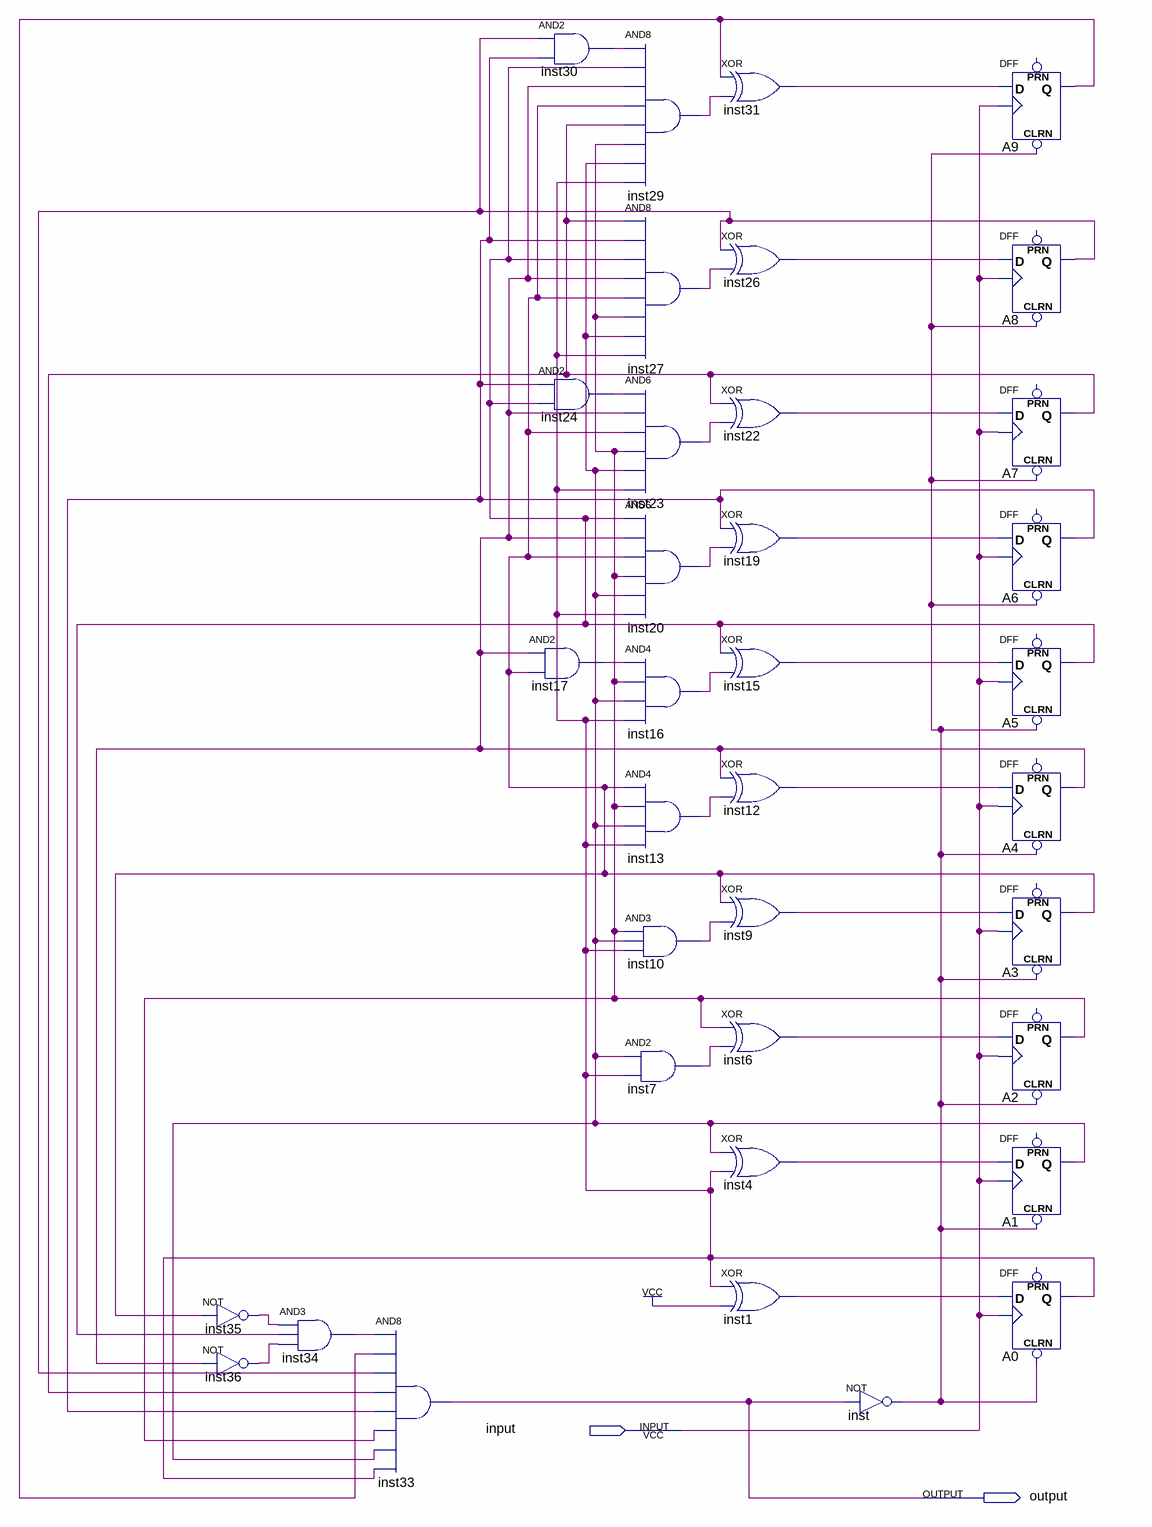
[diagram p0: schematic sheet]
// Quartus schematic time.bdf as structural Verilog: 36 symbols, 2 pins
module \time  (
  input  \input ,
  output \output 
);

  wire A0_q, A1_q, A2_q, A3_q, A4_q, A5_q, A6_q, A7_q, A8_q, A9_q, inst1_out, inst4_out, inst6_out,
       inst7_out, inst9_out, inst10_out, inst12_out, inst13_out, inst15_out, inst16_out, inst17_out,
       inst19_out, inst20_out, inst22_out, inst23_out, inst24_out, inst26_out, inst27_out, inst29_out,
       inst30_out, inst31_out, inst34_out, inst35_out, inst36_out, inst_out;

  not inst35 (inst35_out, A3_q);
  not inst36 (inst36_out, A4_q);
  and inst34 (inst34_out, inst35_out, A5_q, inst36_out);
  and inst33 (\output , inst34_out, A9_q, A8_q, A7_q, A6_q, A2_q, A1_q, A0_q);
  and inst30 (inst30_out, A8_q, A6_q);
  and inst24 (inst24_out, A6_q, A5_q);
  and inst17 (inst17_out, A4_q, A3_q);
  and inst29 (inst29_out, inst30_out, A5_q, A4_q, A3_q, A7_q, A2_q, A1_q, A0_q);
  and inst27 (inst27_out, A7_q, A6_q, A5_q, A4_q, A3_q, A2_q, A1_q, A0_q);
  and inst23 (inst23_out, inst24_out, A4_q, A3_q, A2_q, A1_q, A0_q);
  and inst20 (inst20_out, A5_q, A4_q, A3_q, A2_q, A1_q, A0_q);
  and inst16 (inst16_out, inst17_out, A2_q, A1_q, A0_q);
  and inst13 (inst13_out, A3_q, A2_q, A1_q, A0_q);
  and inst10 (inst10_out, A2_q, A1_q, A0_q);
  and inst7 (inst7_out, A1_q, A0_q);
  xor inst31 (inst31_out, A9_q, inst29_out);
  xor inst26 (inst26_out, A8_q, inst27_out);
  xor inst22 (inst22_out, A7_q, inst23_out);
  xor inst19 (inst19_out, A6_q, inst20_out);
  xor inst15 (inst15_out, A5_q, inst16_out);
  xor inst12 (inst12_out, A4_q, inst13_out);
  xor inst9 (inst9_out, A3_q, inst10_out);
  xor inst6 (inst6_out, A2_q, inst7_out);
  xor inst4 (inst4_out, A1_q, A0_q);
  xor inst1 (inst1_out, A0_q, 1'b1);
  not inst (inst_out, \output );
  DFF A9 (.CLRN(inst_out), .CLK(\input ), .D(inst31_out), .Q(A9_q));  // open: PRN
  DFF A8 (.CLRN(inst_out), .CLK(\input ), .D(inst26_out), .Q(A8_q));  // open: PRN
  DFF A7 (.CLRN(inst_out), .CLK(\input ), .D(inst22_out), .Q(A7_q));  // open: PRN
  DFF A6 (.CLRN(inst_out), .CLK(\input ), .D(inst19_out), .Q(A6_q));  // open: PRN
  DFF A5 (.CLRN(inst_out), .CLK(\input ), .D(inst15_out), .Q(A5_q));  // open: PRN
  DFF A4 (.CLRN(inst_out), .CLK(\input ), .D(inst12_out), .Q(A4_q));  // open: PRN
  DFF A3 (.CLRN(inst_out), .CLK(\input ), .D(inst9_out), .Q(A3_q));  // open: PRN
  DFF A2 (.CLRN(inst_out), .CLK(\input ), .D(inst6_out), .Q(A2_q));  // open: PRN
  DFF A1 (.CLRN(inst_out), .CLK(\input ), .D(inst4_out), .Q(A1_q));  // open: PRN
  DFF A0 (.CLRN(inst_out), .CLK(\input ), .D(inst1_out), .Q(A0_q));  // open: PRN
endmodule
